# Altium project PCB_Project.PrjPcb
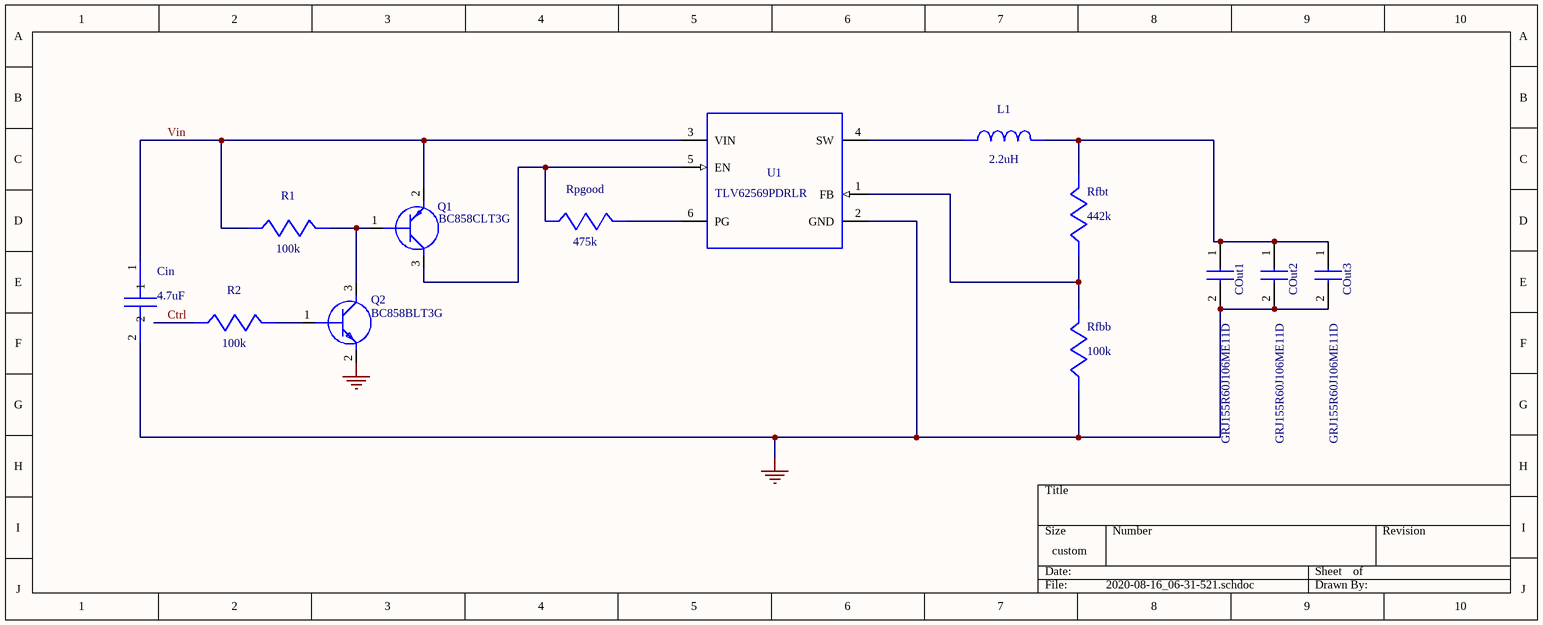
[diagram p0: 2020-08-16_06-31-521.schdoc]
1 sheet, 13 parts. Net scope: global (net labels, ports and power ports of the same name join across sheets).
Board file: 2020-08-16_06-31-521.PcbDoc

## Sheet 2020-08-16_06-31-521.schdoc
size 288 x 115 mm; SheetNumber: 1; SheetTotal: 1

### Parts
Cin  value 4.7uF  (hidden comment: Comment)
COut1  GRJ155R60J106ME11D  [CAPC1005X70N]
COut2  GRJ155R60J106ME11D  [CAPC1005X70N]
COut3  GRJ155R60J106ME11D  [CAPC1005X70N]
L1  value 2.2uH  (hidden comment: Comment)
Q1  BC858CLT3G  [BC858CLT3G]
Q2  BC858BLT3G  [SOT96P237X111-3N]
R1  value 100k  (hidden comment: RR1220P-104-D)
R2  value 100k  (hidden comment: RR1220P-104-D)
Rfbb  value 100k  (hidden comment: Comment)
Rfbt  value 442k  (hidden comment: Comment)
Rpgood  value 475k  (hidden comment: Comment)
U1  Comment  (value not drawn)

### Nets
0: Cin.2 COut1.2 COut2.2 COut3.2 Q2.2(E) Rfbb.2 U1.2(GND)
Ctrl: R2.2
Vin: Cin.1 Q1.2(E) R1.2 U1.3(VIN)
NetCOut1_1: COut1.1 COut2.1 COut3.1 L1.2 Rfbt.1
NetL1_1: L1.1 U1.4(SW)
NetQ1_1: Q1.1(B) Q2.3(C) R1.1
NetQ1_3: Q1.3(C) Rpgood.2 U1.5(EN)
NetQ2_1: Q2.1(B) R2.1
NetRfbb_1: Rfbb.1 Rfbt.2 U1.1(FB)
NetRpgood_1: Rpgood.1 U1.6(PG)

### Library data of the parts
Cin = GRM155R61A475MEAAD: GRM155R61A475MEA; Manufacturer Name: MuRata; PackageReference: GRM155R61A475MEAAD; Manufacturer Part Number: GRM155R61A475MEAAD
COut1-COut3 = GRJ155R60J106ME11D: Capacitor; Manufacturer_Name: Murata Electronics; Datasheet Link: https://componentsearchengine.com//GRJ155R60J106ME11D.pdf; Height: 0.7mm; Mouser2 Part Number: 81-GRJ155R60J106ME1D; Mouser2 Price/Stock: https://www.mouser.com/Search/Refine.aspx?Keyword=81-GRJ155R60J106ME1D; Manufacturer_Part_Number: GRJ155R60J106ME11D
L1 = IHLP2020CZER2R2M11: Unknown; Manufacturer Name: Vishay-Dale; PackageReference: IHLP2020CZER2R2M11; Manufacturer Part Number: IHLP2020CZER2R2M11
Q1 = BC858CLT3G: Transistor BJT PNP; Manufacturer_Name: ON Semiconductor; Datasheet Link: https://componentsearchengine.com//BC858CLT3G.pdf; Mouser2 Part Number: 863-BC858CLT3G; Mouser2 Price/Stock: https://www.mouser.com/Search/Refine.aspx?Keyword=863-BC858CLT3G; Manufacturer_Part_Number: BC858CLT3G
Q2 = BC858BLT3G: Transistor BJT PNP; Manufacturer_Name: ON Semiconductor; Datasheet Link: https://www.onsemi.com/pub/Collateral/BC856ALT1-D.PDF; Height: 1.11mm; Manufacturer_Part_Number: BC858BLT3G
R1 R2 = RR1220P-104-D: Manufacturer Name: Susumu Co Ltd; PackageReference: RR1220P-104-D; Manufacturer Part Number: RR1220P-104-D
Rfbb = CRCW0402100KFKED: Manufacturer Name: Vishay-Dale; PackageReference: CRCW0402100KFKED; Manufacturer Part Number: CRCW0402100KFKED
Rfbt = RC0201FR-07442KL: Manufacturer Name: Yageo; PackageReference: RC0201FR-07442KL; Manufacturer Part Number: RC0201FR-07442KL
Rpgood = CRCW0402475KFKED: Manufacturer Name: Vishay-Dale; PackageReference: CRCW0402475KFKED; Manufacturer Part Number: CRCW0402475KFKED
U1 = TLV62569PDRLR: Manufacturer Name: Texas Instruments; PackageReference: TLV62569PDRLR; Manufacturer Part Number: TLV62569PDRLR; Value: N/A